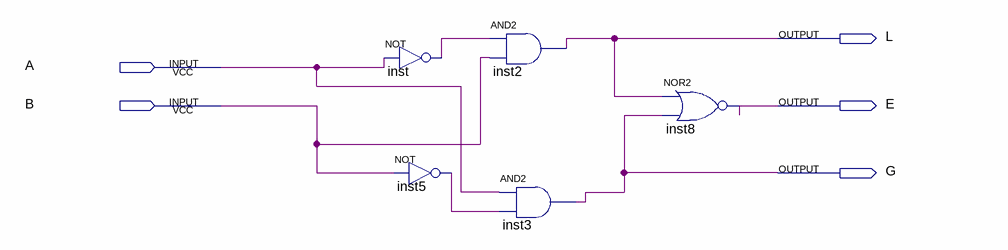
[diagram p0: schematic sheet]
// Quartus schematic comparator_1bit.bdf as structural Verilog: 5 symbols, 5 pins
module comparator_1bit (
  input  A,
  input  B,
  output L,
  output E,
  output G
);

  wire inst5_out, inst_out;

  not inst (inst_out, A);
  not inst5 (inst5_out, B);
  and inst2 (L, inst_out, B);
  and inst3 (G, A, inst5_out);
  nor inst8 (E, L, G);
endmodule
